# EAGLE design 4ch_mosfet_switch (EAGLE 6.4)
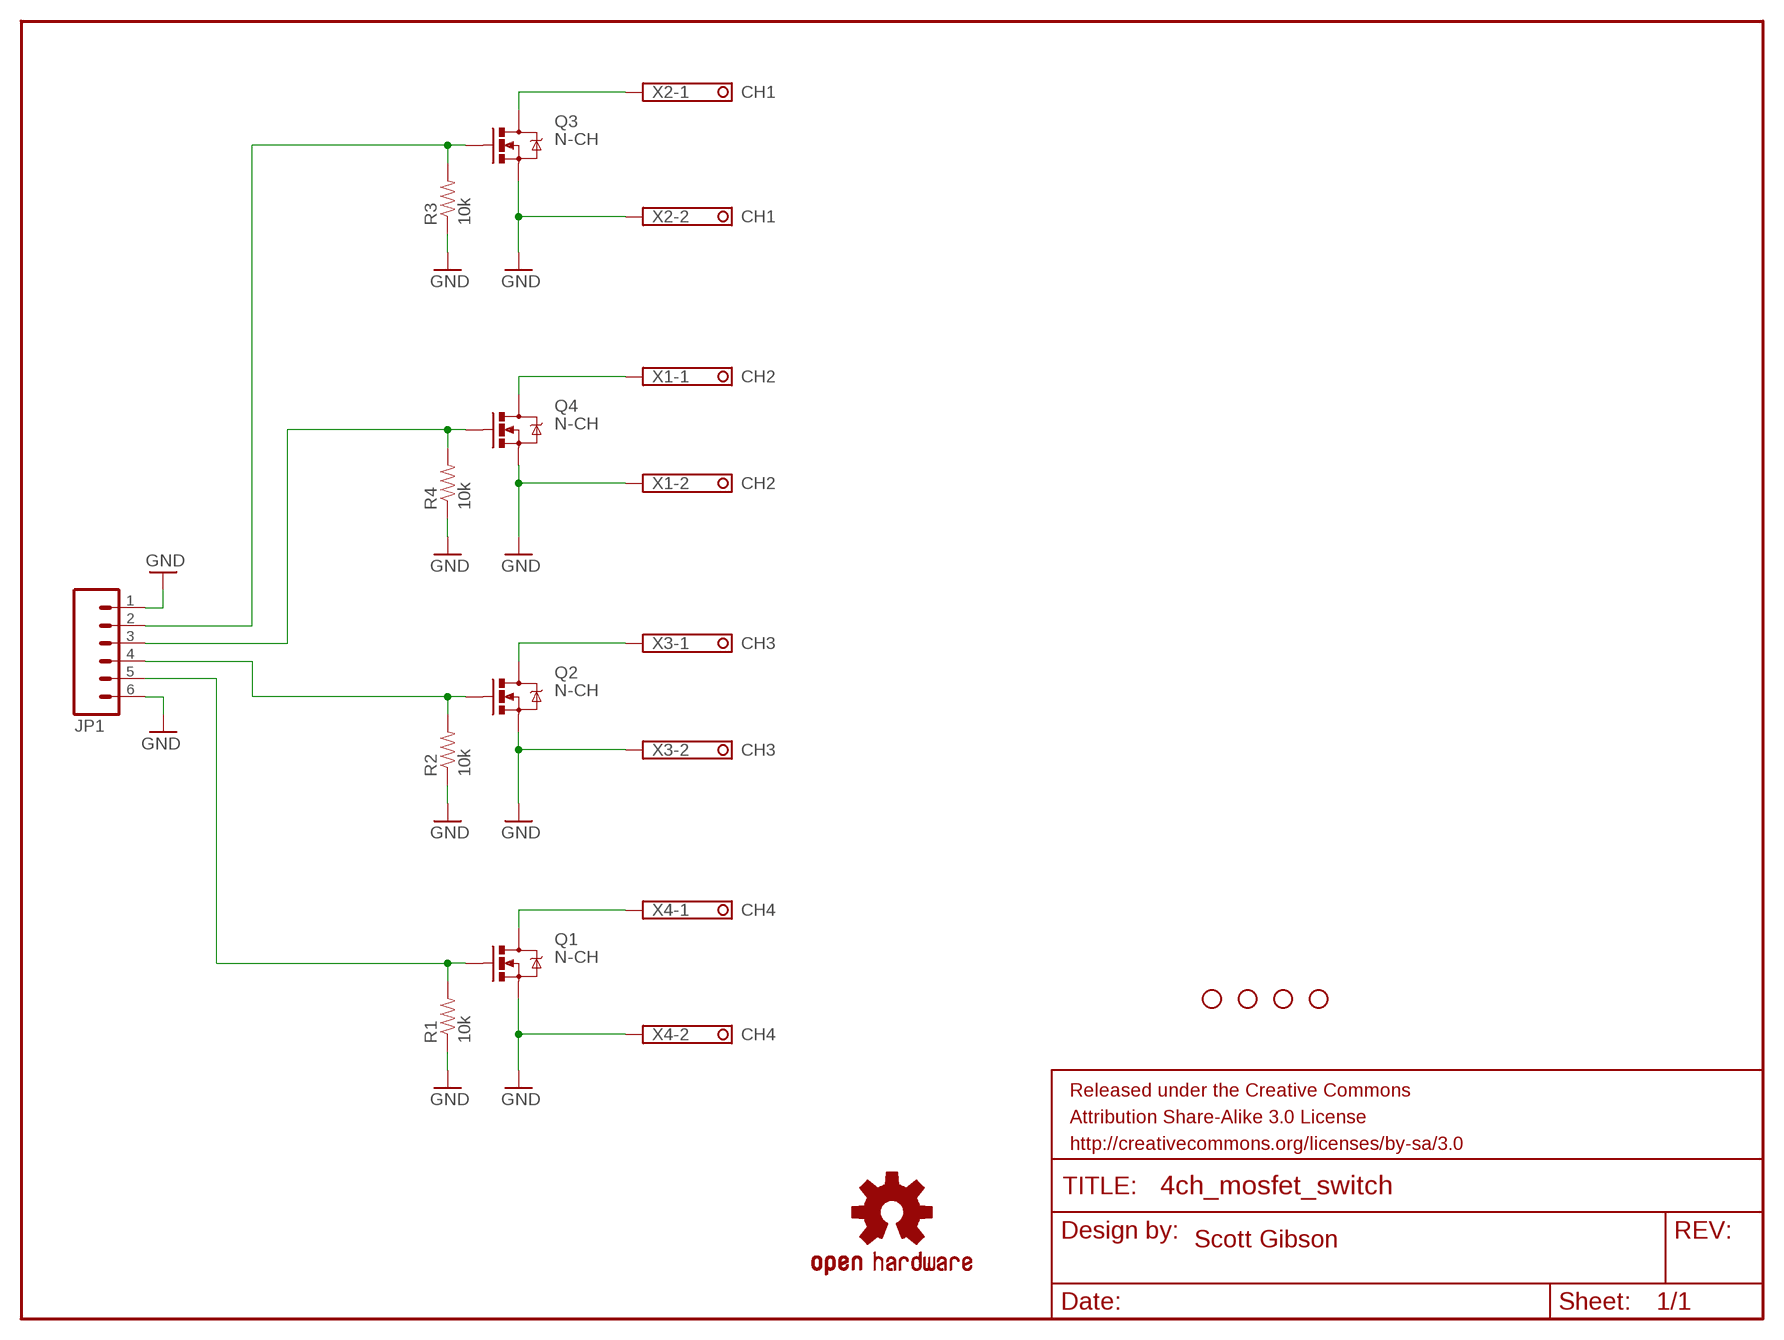
[diagram p0: schematic, sheet 1]

## Parts
FRAME1  FRAME-LETTER  [CREATIVE_COMMONS]
JP1  M06LOCK_LONGPADS  [1X06_LOCK_LONGPADS]
LOGO1  OSHW-LOGOM  [OSHW-LOGO-M]
Q1  N-CH  MOSFET-NCHANNELFQP30N06L  [TO220V]
Q2  N-CH  MOSFET-NCHANNELFQP30N06L  [TO220V]
Q3  N-CH  MOSFET-NCHANNELFQP30N06L  [TO220V]
Q4  N-CH  MOSFET-NCHANNELFQP30N06L  [TO220V]
R1  10k  RESISTORAXIAL-0.3  [AXIAL-0.3]
R2  10k  RESISTORAXIAL-0.3  [AXIAL-0.3]
R3  10k  RESISTORAXIAL-0.3  [AXIAL-0.3]
R4  10k  RESISTORAXIAL-0.3  [AXIAL-0.3]
STANDOFF1  STAND-OFF  [STAND-OFF]
STANDOFF2  STAND-OFF  [STAND-OFF]
STANDOFF3  STAND-OFF  [STAND-OFF]
STANDOFF4  STAND-OFF  [STAND-OFF]
X1  CH2  1751248  [1751248]
X2  CH1  1751248  [1751248]
X3  CH3  1751248  [1751248]
X4  CH4  1751248  [1751248]

## Nets
GND: JP1.1 JP1.6 Q1.3(S) Q2.3(S) Q3.3(S) Q4.3(S) R1.P$1 R2.P$1 R3.P$1 R4.P$1 X1.2 X2.2 X3.2 X4.2
N$1: JP1.3 Q4.1(G) R4.P$2
N$2: JP1.2 Q3.1(G) R3.P$2
N$3: JP1.4 Q2.1(G) R2.P$2
N$4: JP1.5 Q1.1(G) R1.P$2
N$5: Q1.2(D) X4.1
N$6: Q2.2(D) X3.1
N$7: Q3.2(D) X2.1
N$8: Q4.2(D) X1.1

## Notes on the sheet
- Scott Gibson

## Library data of the parts
FRAME1 = SparkFun-Aesthetics:FRAME-LETTER: Schematic Frame Standard 8.5x11 US Letter frame
JP1 = SparkFun-Connectors:M06: Header 6 Standard 6-pin 0.1" header. Use with straight break away headers (SKU : PRT-00116), right angle break away headers (PRT-00553), swiss pins (PRT-00743), machine pins (PRT-00117), and female headers (PRT-00115). Molex polarized connector foot print use with SKU : PRT-08094 with associated crimp pins and housings. NOTES ON THE VARIANTS LOCK and LOCK_LONGPADS... This footprint was designed to help hold the alignment of a through-hole component (i.e. 6-pin header) while soldering it into place. You may notice that each hole has been shifted either up or down by 0.005 of an inch from it's more standard position (which is a perfectly straight line). This slight alteration caused the pins (the squares in the middle) to touch the edges of the holes. Because they are alternating, it causes a "brace" to hold the component in place. 0.005 has proven to be the perfect amount of "off-center" position when using our standard breakaway headers. Although looks a little odd when you look at the bare footprint, once you have a header in there, the alteration is very hard to notice. Also,if you push a header all the way into place, it is covered up entirely on the bottom side. This idea of altering the position of holes to aid alignment will be further integrated into the Sparkfun Library for other footprints. It can help hold any component with 3 or more connection pins.
LOGO1 = SparkFun-Aesthetics:OSHW-LOGO: Open Source Hardware Logo This logo indicates the piece of hardware it is found on incorporates a OSHW license and/or adheres to the definition of open source hardware found here: http://freedomdefined.org/OSHW
Q1-Q4 = SparkFun-DiscreteSemi:MOSFET-NCHANNEL: Common NMOSFET Parts MFG P/N Store ID Prod ID FDD8780 TRANS-09984 SI7820DN TRANS-11055 FDS6630A IC-08089 2N7002PW TRANS-11151 FQP30N06L COM-10213 TRANS-10060 BSS123LT1G TRANS-08345 BSS138 TRANS-00830 BS170 2N7000; PROD_ID: TRANS-10060
R1-R4 = SparkFun-Passives:RESISTOR: Resistor Basic schematic elements and footprints for 0603, 1206, and PTH resistors.
STANDOFF1-STANDOFF4 = SparkFun-Electromechanical:STAND-OFF: #4 Stand Off This is the mechanical footprint for a #4 phillips button head screw. Use the keepout ring to avoid running the screw head into surrounding components. SKU : PRT-00447
X1-X4 = con-phoenix-350:1751248: MKDS 1/ 2-3,5 Printklemme Nennstrom: 10 A Bemessungsspannung: 160 V Raster: 3,5 mm Polzahl: 2 Montageart: Löten Anschlussart: Schraubanschluss Anschlussrichtung vom Leiter zur Platine: 0° Source: http://eshop.phoenixcontact.com .. 1751248.pdf; OC_FARNELL: unknown; OC_NEWARK: unknown

## Board
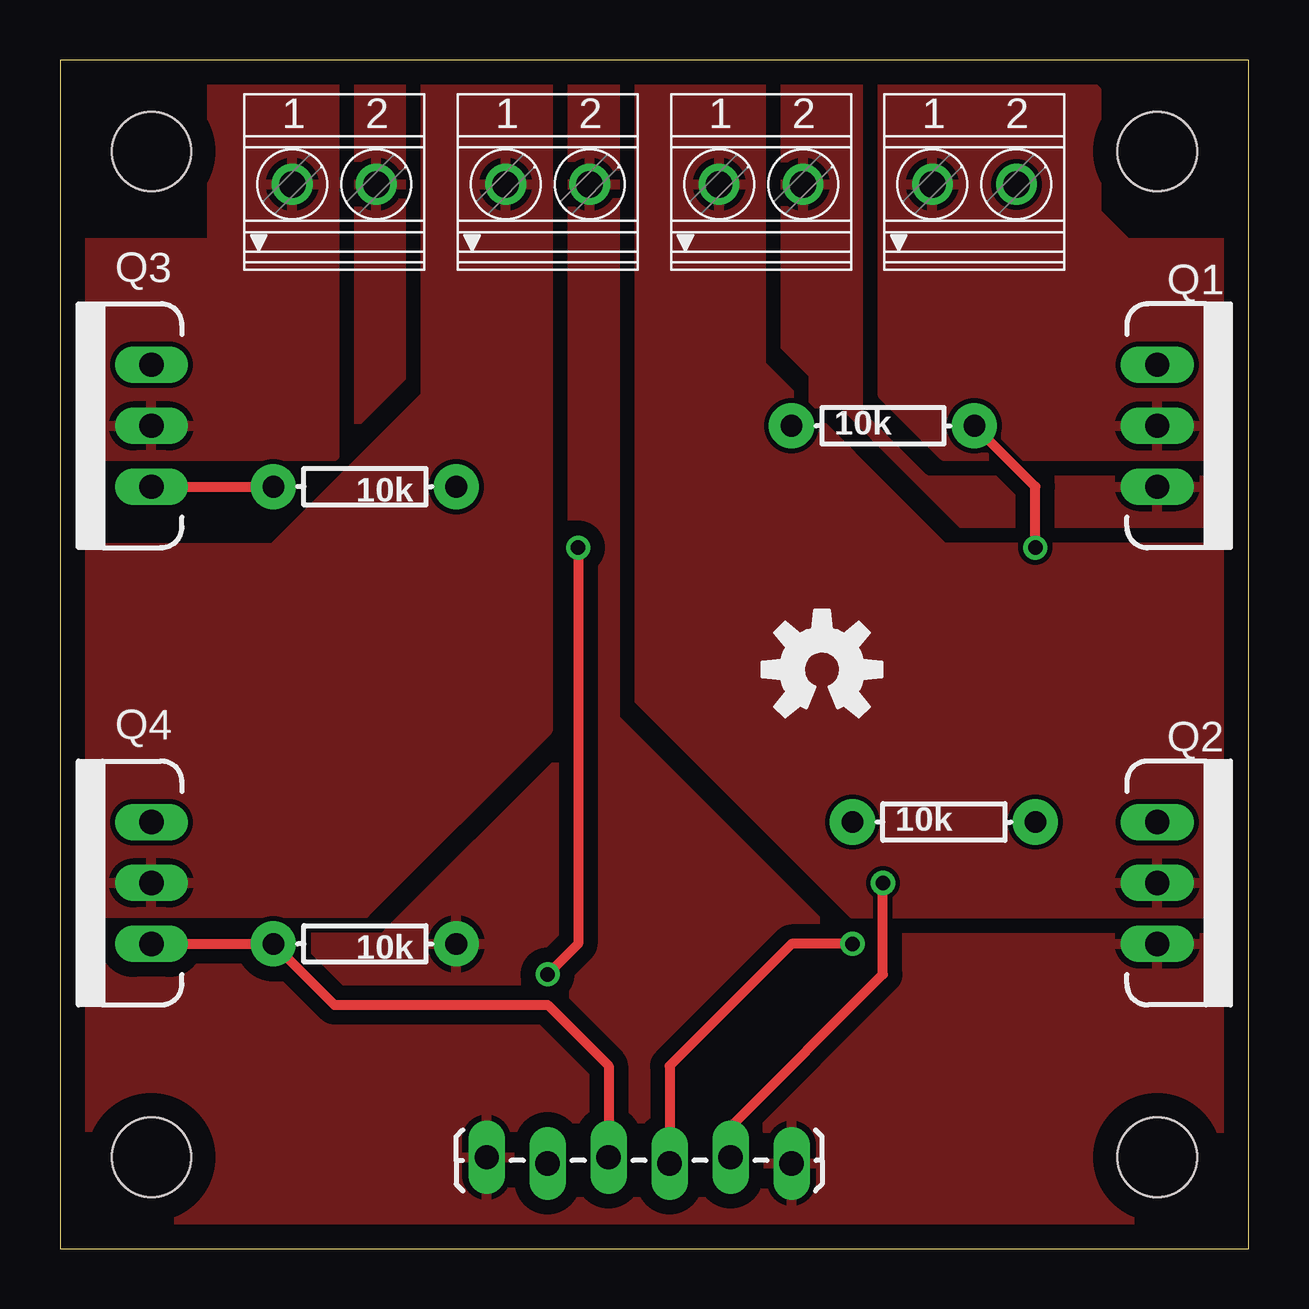
[diagram p1: board, top side]
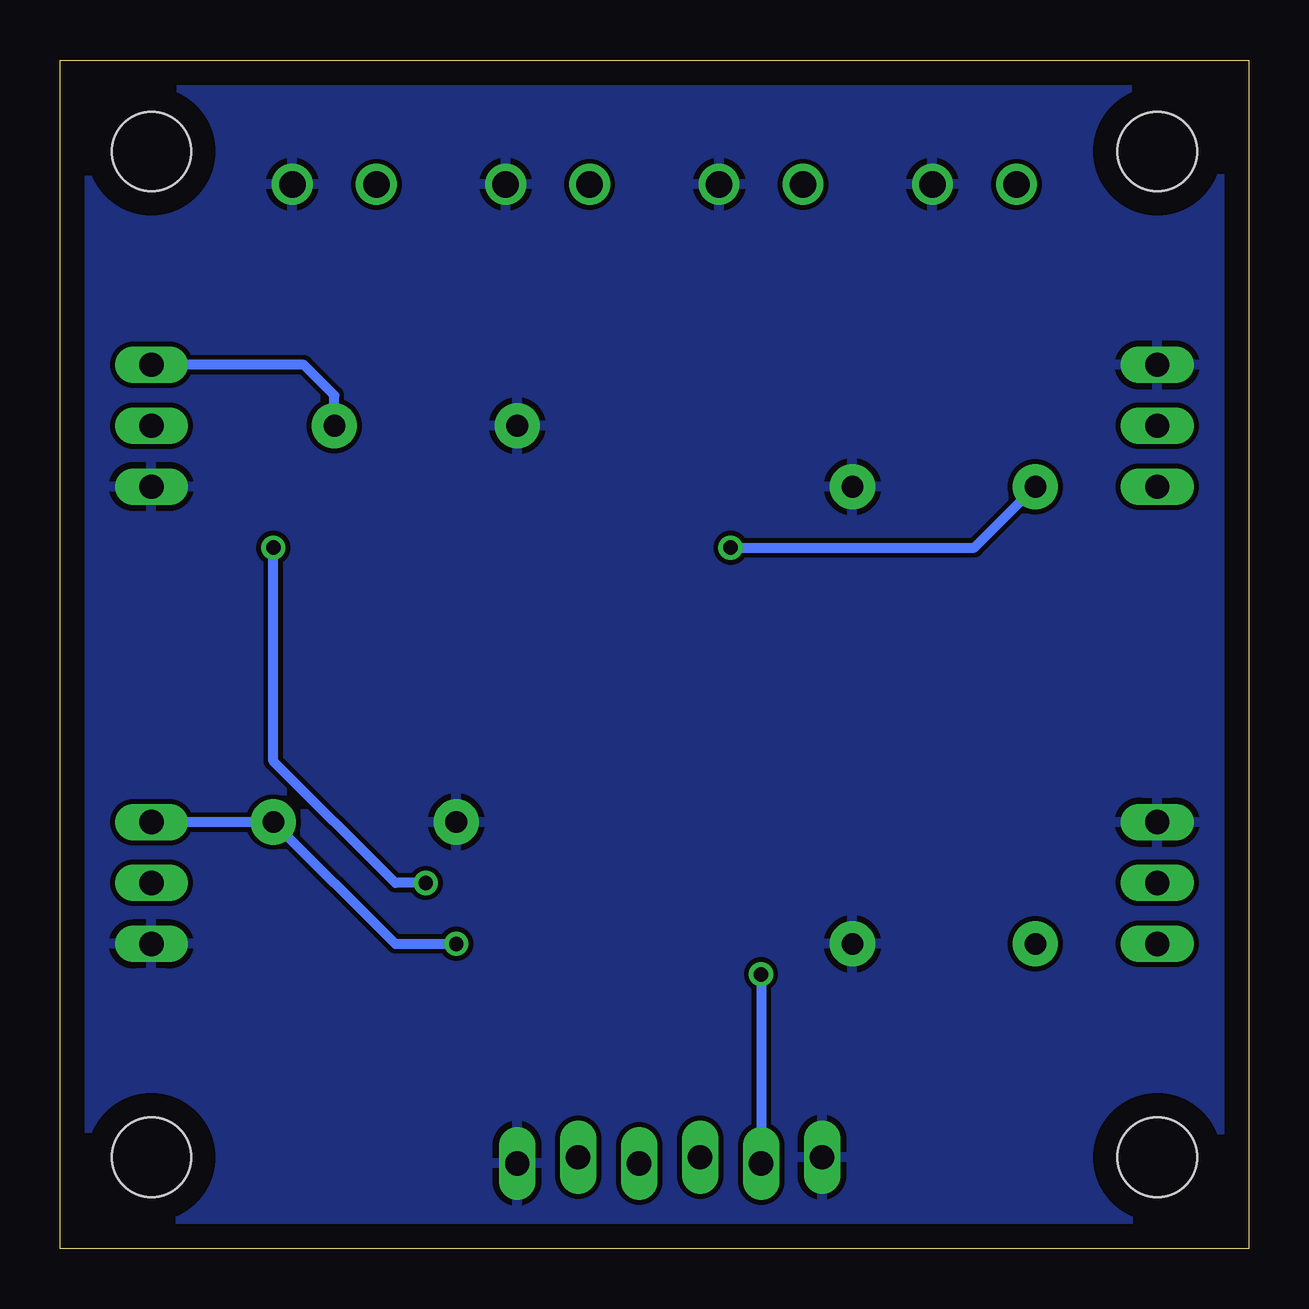
[diagram p2: board, bottom side, seen from below]

Size 49.53 x 49.53 mm. Coordinates in mm from the lower left corner, seen from the top.
Outline: 0,0 49.53,0 49.53,49.53 0,49.53 0,0
Copper layers (1*16): Top 0.035mm / dielectric 1.5mm / Bottom 0.035mm
Design rules "default": minimum track width 10mil, minimum drill 24mil, track to track 8mil, track to pad 8mil, pad to pad 8mil, via to via 8mil, smd to smd 8mil, copper to edge 40mil, drill to drill 8mil, minimum pad ring 10mil, minimum via ring 8mil, stop-mask expansion 4mil, vias tented up to drill 0mil, thermal gap 10mil

### Footprints (pad centres in the part's own frame; a part is rotated, then mirrored left to right if it is on the bottom)
1X06_LOCK_LONGPADS = drill 1.016 long: 1 0,0; 2 2.54,-0.254; 3 5.08,0; 4 7.62,-0.254; 5 10.16,0; 6 12.7,-0.254
TO220V = drill 1.016 long: 1 -2.54,0; 2 0,0; 3 2.54,0
AXIAL-0.3 = drill 0.9 pad 1.88: P$1 -3.81,0; P$2 3.81,0
STAND-OFF = hole 3.302: 0,0
1751248 = drill 1.1 pad 1.7: 1 -1.75,-0.1; 2 1.75,-0.1

### Placement (x,y rotation side)
FRAME1  26.67,-10.16 0 top  (outside the outline)
JP1  17.78,3.81 0 top
LOGO1  31.75,24.13 0 top
Q1  45.72,34.29 270 top
Q2  45.72,15.24 270 top
Q3  3.81,34.29 90 top
Q4  3.81,15.24 90 top
R1  34.29,34.29 0 top
R2  36.83,17.78 0 top
R3  12.7,31.75 180 top
R4  12.7,12.7 180 top
STANDOFF1  45.72,3.81 0 top
STANDOFF2  45.72,45.72 0 top
STANDOFF3  3.81,3.81 0 top
STANDOFF4  3.81,45.72 0 top
X1  20.32,44.45 0 top
X2  11.43,44.45 0 top
X3  29.21,44.45 0 top
X4  38.1,44.45 0 top

### Tracks (layer width: path | path; a pad name or v marks a point on that pad's centre or on a via)
GND
  pour Bottom: 0,49.53 49.53,49.53 49.53,0 0,0
  pour Top (isolate 0.61, rank 4): 0,49.53 49.53,49.53 49.53,0 0,0
N$1
  Top 0.406: Q4.1 R4.P$2 11.43,10.16 20.32,10.16 22.86,7.62 JP1.3
N$2  (via drill 0.6)
  Top 0.406: Q3.1 R3.P$2 | v21.59,29.21 21.59,12.7 v20.32,11.43
  Bottom 0.406: v21.59,29.21 11.43,29.21 R3.P$2 | v20.32,11.43 JP1.2
N$3  (via drill 0.6)
  Top 0.406: v33.02,12.7 30.48,12.7 25.4,7.62 JP1.4
  Bottom 0.406: Q2.1 R2.P$2 35.56,12.7 v33.02,12.7
N$4  (via drill 0.6)
  Top 0.406: JP1.5 27.94,5.08 34.29,11.43 v34.29,15.24 | v40.64,29.21 40.64,31.75 R1.P$2
  Bottom 0.406: R1.P$2 38.1,35.56 39.37,36.83 Q1.1 | v34.29,15.24 35.56,15.24 40.64,20.32 v40.64,29.21
N$5
  pour Top: 34.29,49.53 41.91,49.53 43.18,48.26 43.18,43.18 44.45,41.91 49.53,41.91 49.53,33.02 36.83,33.02 34.29,35.56
N$6
  pour Top: 24.13,49.53 24.13,22.86 33.02,13.97 49.53,13.97 49.53,29.21 36.83,29.21 29.21,36.83 29.21,49.53
N$7
  pour Top: 6.35,49.53 11.43,49.53 11.43,33.02 0,33.02 0,41.91 6.35,41.91
N$8
  pour Top: 16.51,49.53 20.32,49.53 20.32,21.59 12.7,13.97 0,13.97 0,29.21 8.89,29.21 15.24,35.56 15.24,49.53

### Text on the board
tPlace: Scott Gibson
tValues: GND | GND | GND | GND | http://www.thegreatgeekery.com | 4ch_mosfet_switch | V1.0 | GND | CH1 | CH2 | CH3 | CH4 | GND